# Altium project controller.PrjPcb
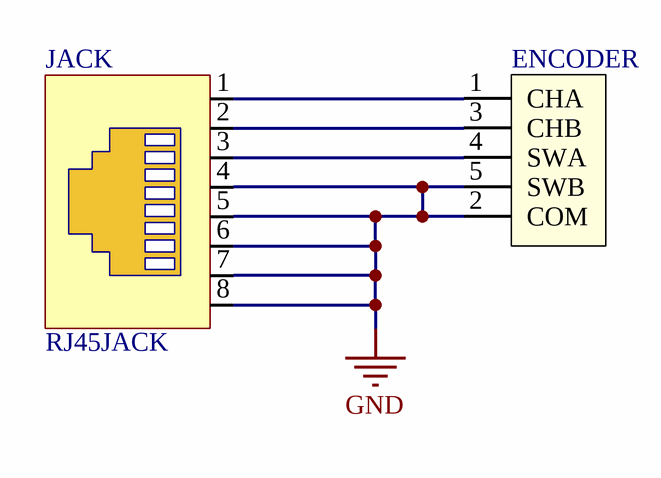
[diagram p0: controller.SchDoc]
1 sheet, 2 parts. Net scope: global (net labels, ports and power ports of the same name join across sheets).
Board file: controller.PcbDoc

## Sheet controller.SchDoc
size 290 x 209 mm

### Parts
ENCODER  ROTARY_ENCODER  [ENCODER]  (value not drawn)
JACK  RJ45JACK  [RJHSE-5080]

### Nets
GND: ENCODER.2(COM) ENCODER.5(SWB) JACK.4 JACK.5 JACK.6 JACK.7 JACK.8
NetENCODER_1: ENCODER.1(CHA) JACK.1
NetENCODER_3: ENCODER.3(CHB) JACK.2
NetENCODER_4: ENCODER.4(SWA) JACK.3

### Library data of the parts
ENCODER = ROTARY_ENCODER: Rotary Encoder